# EAGLE schematic tutisduino (EAGLE 6.0)
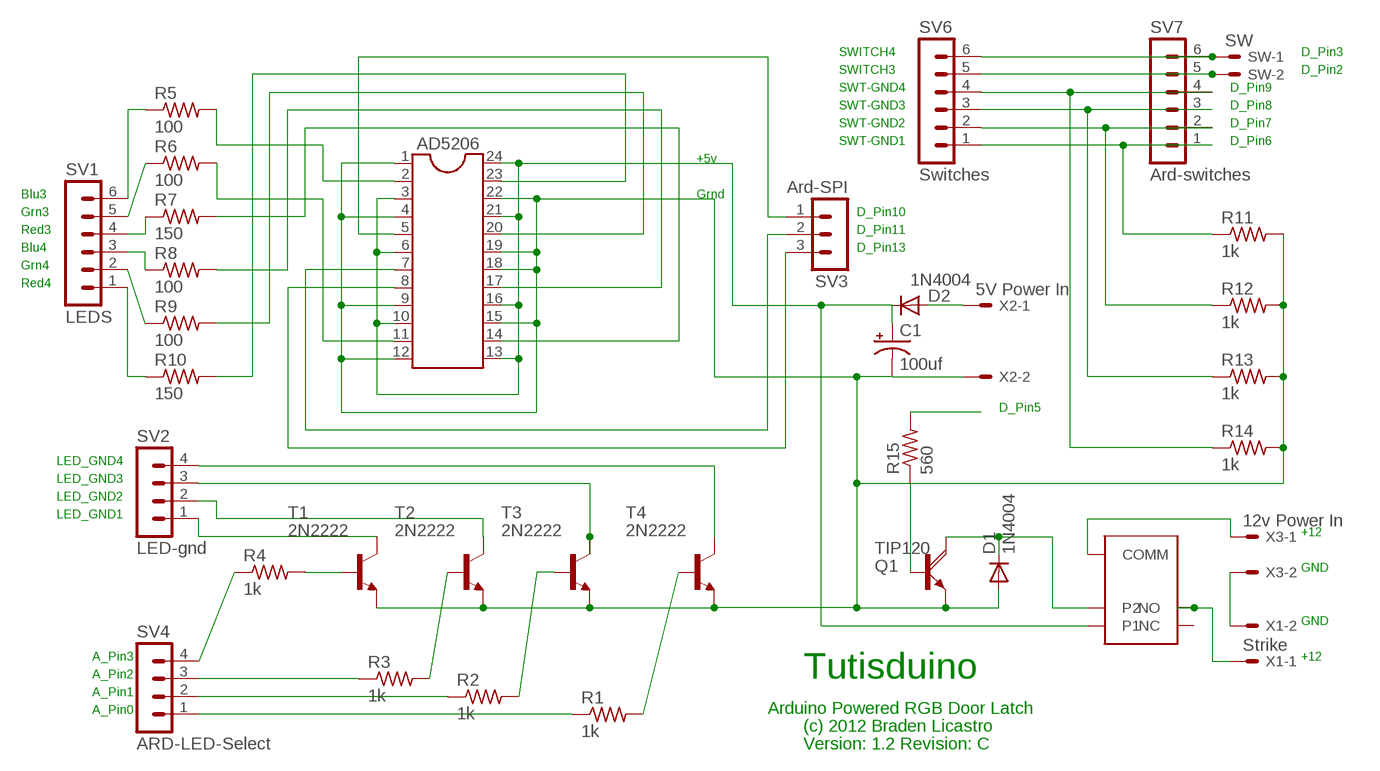
[diagram p0: schematic, sheet 1]

## Parts
AD5206  DIL24-3  [DIL24-3]
C1  100uf  CPOL-USE2-5  [E2-5]
D1  1N4004  [DO41-10]
D2  1N4004  [DO41-10]
OUAZ-SS-105D  OUAZ-SS-105D  [OUAZ-SS-105D]
Q1  TIP120  [TO220AH]
R1  1k  R-US_0204/2V  [0204V]
R2  1k  R-US_0204/2V  [0204V]
R3  1k  R-US_0204/2V  [0204V]
R4  1k  R-US_0204/2V  [0204V]
R5  100  R-US_0204/2V  [0204V]
R6  100  R-US_0204/2V  [0204V]
R7  150  R-US_0204/2V  [0204V]
R8  100  R-US_0204/2V  [0204V]
R9  100  R-US_0204/2V  [0204V]
R10  150  R-US_0204/2V  [0204V]
R11  1k  R-US_0204/2V  [0204V]
R12  1k  R-US_0204/2V  [0204V]
R13  1k  R-US_0204/2V  [0204V]
R14  1k  R-US_0204/2V  [0204V]
R15  560  R-US_0204/2V  [0204V]
SV1  LEDS  MA06-1  [MA06-1]
SV2  LED-gnd  MA04-1  [MA04-1]
SV3  Ard-SPI  MA03-1  [MA03-1]
SV4  ARD-LED-Select  MA04-1  [MA04-1]
SV6  Switches  MA06-1  [MA06-1]
SV7  Ard-switches  MA06-1  [MA06-1]
SW  SW  22-23-2021  [22-23-2021]
T1  2N2222  [TO18]
T2  2N2222  [TO18]
T3  2N2222  [TO18]
T4  2N2222  [TO18]
X1  Strike  22-23-2021  [22-23-2021]
X2  5V Power In  22-23-2021  [22-23-2021]
X3  12v Power In  22-23-2021  [22-23-2021]

## Nets
LEDS: AD5206.2 R5.2
N$1: SV6.6 SV7.6 SW.1
N$2: R4.1 SV4.4
N$3: OUAZ-SS-105D.NO X1.1
N$4: AD5206.1 AD5206.4 AD5206.9 AD5206.12 AD5206.15 AD5206.18 AD5206.19 AD5206.22 C1.- D1.A Q1.E R11.2 R12.2 R13.2 R14.2 T1.1(E) T2.1(E) T3.1(E) T4.1(E) X2.2
N$5: Q1.B R15.1
N$6: AD5206.11 R6.2
N$7: AD5206.14 R7.2
N$8: AD5206.17 R8.2
N$9: AD5206.20 R9.2
N$10: AD5206.23 R10.2
N$11: R4.2 T1.2(B)
N$12: R3.1 SV4.3
N$13: R2.1 SV4.2
N$14: R1.1 SV4.1
N$15: AD5206.5 SV3.1
N$16: AD5206.7 SV3.2
N$17: AD5206.8 SV3.3
N$18: R3.2 T2.2(B)
N$19: R2.2 T3.2(B)
N$20: R1.2 T4.2(B)
N$21: R15.2
N$22: X1.2 X3.2
N$23: SV6.5 SV7.5 SW.2
N$24: R14.1 SV6.4 SV7.4
N$25: R13.1 SV6.3 SV7.3
N$26: R12.1 SV6.2 SV7.2
N$27: R11.1 SV6.1 SV7.1
N$28: SV2.1 T1.3(C)
N$29: SV2.2 T2.3(C)
N$30: SV2.3 T3.3(C)
N$31: SV2.4 T4.3(C)
N$32: R5.1 SV1.6
N$33: R6.1 SV1.5
N$34: R7.1 SV1.4
N$35: R8.1 SV1.3
N$36: R9.1 SV1.2
N$37: R10.1 SV1.1
N$39: D1.C OUAZ-SS-105D.P2 Q1.C
N$40: OUAZ-SS-105D.COMM X3.1
N$41: AD5206.3 AD5206.6 AD5206.10 AD5206.13 AD5206.16 AD5206.21 AD5206.24 C1.+ D2.C OUAZ-SS-105D.P1
N$42: D2.A X2.1
Unconnected: OUAZ-SS-105D.NC

## Notes on the sheet
- SWITCH4 | D_Pin3
- SWITCH3 | D_Pin2
- SWT-GND4 | D_Pin9
- SWT-GND3 | D_Pin8
- SWT-GND2 | D_Pin7
- SWT-GND1 | D_Pin6
- +5v
- Blu3 | Grnd
- Grn3 | D_Pin10
- Red3 | D_Pin11
- Blu4 | D_Pin13
- Grn4
- Red4
- D_Pin5
- LED_GND4
- LED_GND3
- LED_GND2
- LED_GND1
- +12
- GND
- GND
- A_Pin3 | +12
- A_Pin2 | Tutisduino
- A_Pin1
- A_Pin0 | Arduino Powered RGB Door Latch
- (c) 2012 Braden Licastro
- Version: 1.2 Revision: C

## Library data of the parts
AD5206 = ic-package:DIL24: Dual In Line
C1 = rcl:CPOL-US: POLARIZED CAPACITOR, American symbol
D1 D2 = diode:1N4004: DIODE general purpose rectifier, 1 A
OUAZ-SS-105D = Custom Parts:OUAZ-SS-105D
Q1 = transistor-power:TIP120: NPN DARLINGTON TRANSISTOR
R1-R15 = rcl:R-US_: RESISTOR, American symbol
SV1 SV6 SV7 = con-lstb:MA06-1: PIN HEADER; OC_FARNELL: unknown; OC_NEWARK: unknown
SV2 SV4 = con-lstb:MA04-1: PIN HEADER; OC_FARNELL: unknown; OC_NEWARK: unknown
SV3 = con-lstb:MA03-1: PIN HEADER; OC_FARNELL: unknown; OC_NEWARK: unknown
SW X1-X3 = con-molex:22-23-2021: .100" (2.54mm) Center Header - 2 Pin; MF: MOLEX; MPN: 22-23-2021; OC_FARNELL: 1462926; OC_NEWARK: 25C3832
T1-T4 = transistor:2N2222: NPN TRANSISTOR

## Net classes
0 default: width 0.762 mm